# EAGLE design Alfa_b (EAGLE 9.6.2)
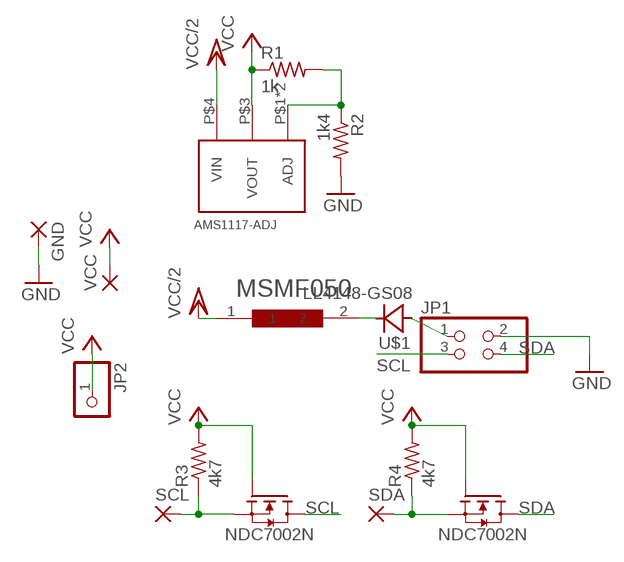
[diagram p0: schematic, sheet 1]

## Parts
AMS1117-ADJ  AMS1117  [SOT223]
GND  SMD2  [SMD1,27-2,54]
JP1  PINHD-2X2  [2X02]
JP2  PINHD-1X1  [1X01]
MSMF050  MF-MSMF050  [MF-MSMF050]
NDC7002N  NDC7002N  [SOT-23-6]
R1  1k  R-US_R0603  [R0603]
R2  1k4  R-US_R0603  [R0603]
R3  4k7  R-US_R0603  [R0603]
R4  4k7  R-US_R0603  [R0603]
SCL  SMD2  [SMD1,27-2,54]
SDA  SMD2  [SMD1,27-2,54]
U$1  LL4148-GS08  [SOD-80]
VCC  SMD2  [SMD1,27-2,54]

## Nets
GND: GND.1(P) JP1.2 R2.2
N$1: MSMF050.2 U$1.2(C)
N$2: JP1.1 U$1.1(A)
N$3: AMS1117-ADJ.P$1(ADJ) AMS1117-ADJ.P$2(ADJ) R1.2 R2.1
N$4: NDC7002N.5(S1) R3.1 SCL.1(P)
N$6: NDC7002N.2(S2) R4.1 SDA.1(P)
SCL: JP1.3 NDC7002N.6(D1)
SDA: JP1.4 NDC7002N.4(D2)
VCC: AMS1117-ADJ.P$3(VOUT) JP2.1 NDC7002N.1(G1) NDC7002N.3(G2) R1.1 R3.2 R4.2 VCC.1(P)
VCC/2: AMS1117-ADJ.P$4(VIN) MSMF050.1

## Library data of the parts
AMS1117-ADJ = CanCubeSat:AMS1117
GND SCL SDA VCC = wirepad:SMD2: SMD PAD
JP1 = pinhead:PINHD-2X2: PIN HEADER
JP2 = pinhead:PINHD-1X1: PIN HEADER
MSMF050 = HM:MF-MSMF050
NDC7002N = HM:NDC7002N
R1-R4 = rcl:R-US_: RESISTOR, American symbol; SPICEPREFIX: R
U$1 = CanCubeSat:LL4148-GS08

## Board
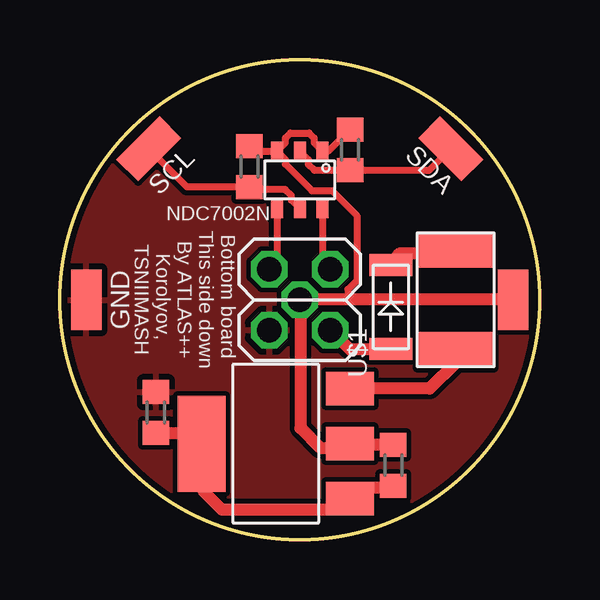
[diagram p1: board, top side]
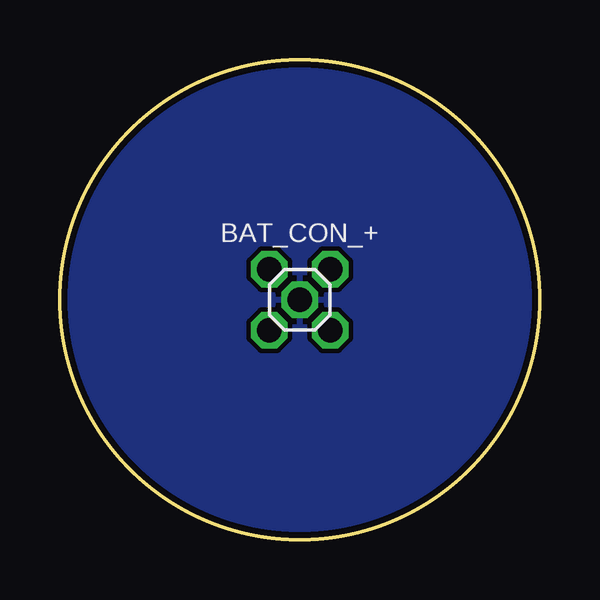
[diagram p2: board, bottom side, seen from below]

Size 20 x 20 mm. Coordinates in mm from the lower left corner, seen from the top.
Outline: circle at 10,10 radius 10
Copper layers (1*16): Top 0.035mm / dielectric 1.5mm / Bottom 0.035mm
Design rules "rezonit": minimum track width 0.25mm, minimum drill 0.35mm, track to track 0.2mm, track to pad 0.2mm, pad to pad 0.15mm, via to via 0.2mm, smd to smd 0.2mm, copper to edge 0.25mm, drill to drill 0.25mm, minimum pad ring 10mil, minimum via ring 8mil, stop-mask expansion 4mil, vias tented up to drill 0mil, thermal gap 10mil

### Footprints (pad centres in the part's own frame; a part is rotated, then mirrored left to right if it is on the bottom)
SOT223 = smd 4 x 2: P$1 0,3.1 | smd 1.4 x 2: P$2 -2.29,-3.1; P$3 0,-3.1; P$4 2.29,-3.1
SMD1,27-2,54 = smd 1.27 x 2.54: 1 0,0
2X02 = drill 1.016 octagon: 1 -1.27,-1.27; 2 -1.27,1.27; 3 1.27,-1.27; 4 1.27,1.27
1X01 = drill 1.016 octagon: 1 0,0
MF-MSMF050 = smd 1.5 x 3.2: 1 -2.1,0; 2 2.1,0
SOT-23-6 = smd 0.5 x 0.8: 1 -0.95,-1.2; 2 0,-1.2; 3 0.95,-1.2; 4 0.95,1.2; 5 0,1.2; 6 -0.95,1.2
R0603 = smd 1 x 1.1: 1 -0.85,0; 2 0.85,0
SOD-80 = smd 0.9 x 1.8: 1 -1.75,0; 2 1.75,0

### Placement (x,y rotation side)
AMS1117-ADJ  9,4 90 top
GND  1.1,10 0 top
JP1  10,10 90 top
JP2  10,10 0 bottom
MSMF050  16.5,10 90 top
NDC7002N  10,15 180 top
R1  13.9,3.1 270 top
R2  4,5.3 90 top
R3  7.9,15.55 90 top
R4  12.1,16.25 90 top
SCL  3.7,16.3 315 top
SDA  16.3,16.3 45 top
U$1  13.8,9.7 90 top
VCC  18.9,10 180 top

### Tracks (layer width: path | path; a pad name or v marks a point on that pad's centre or on a via)
GND
  pour Top: 0,0 0,20 20,20 20,0
N$1
  Top 0.5: U$1.2 14.14,11.93 16.4,11.93 MSMF050.2
N$2
  Top 0.5: U$1.1 13.78,7.92 12.1,7.92 11.47,8.55 JP1.1
N$3
  Top 0.5: 12.15,1.8 AMS1117-ADJ.P$2 | AMS1117-ADJ.P$2 11.64,1.25 6.75,1.25 6,2 6,3.9 AMS1117-ADJ.P$1 | AMS1117-ADJ.P$1 5.9,2.9 | AMS1117-ADJ.P$2 12.54,2.15 13.8,2.15 R1.2 | R2.1 5.45,4.45 AMS1117-ADJ.P$1
N$4
  Top 0.3: 7.79,14.7 R3.1 5.3,14.7 SCL.1 | NDC7002N.5 9.65,14.15 9.65,14.35 9.39,14.6 8,14.6
  Top 0.4: 8,14.6 R3.1
N$6
  Top 0.3: NDC7002N.2 10.35,15.85 10.35,15.65 10.61,15.4 R4.1 15.4,15.4 SDA.1
SCL
  Top 0.3: NDC7002N.6 10.95,11.59 JP1.3
SDA
  Top 0.3: NDC7002N.4 9.05,11.59 JP1.4
VCC
  Top 0.3: R3.2 8.1,16.2 NDC7002N.3 | NDC7002N.3 9.4,16.55 9.4,16.75 9.61,16.95 10.39,16.95 10.6,16.75 10.6,16.55 NDC7002N.1 11.2,16.2 R4.2 | NDC7002N.3 9.4,15.85 9.4,15.65 10.51,14.55 11.35,14.55 12.38,13.51 12.38,10.81 12,10.43 12,10.03
  Top 0.5: 12.15,3.83 AMS1117-ADJ.P$3 | VCC.1 18.9,10.03 12,10.03 10.03,10.03 JP2.1 10.03,9.98 10.03,4.65 10.85,3.83 12.15,3.83 | R1.1 12.28,3.95 12.15,3.83
  pour Bottom: 0,0 0,20 20,20 20,0
VCC/2
  Top 0.5: MSMF050.1 16.5,7.38 15.43,6.3 12.15,6.3 AMS1117-ADJ.P$4

### Text on the board
tNames: Bottom board / This side down / By ATLAS++ / Korolyov, / TSNIIMASH
bNames: BAT_CON_+